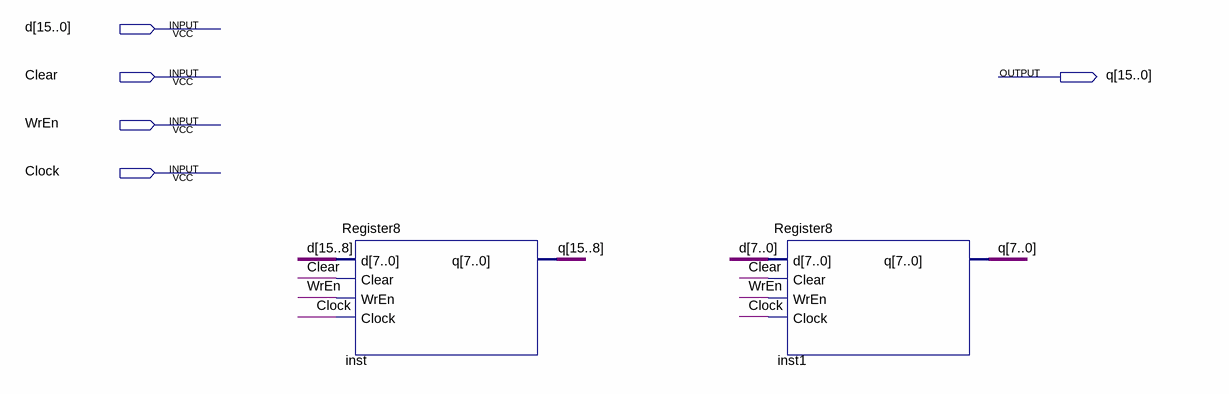
[diagram p0: schematic sheet]
// Quartus schematic Register16.bdf as structural Verilog: 2 symbols, 5 pins
module Register16 (
  input  [15:0] d,
  input  Clear,
  input  WrEn,
  input  Clock,
  output [15:0] q
);

  Register8 inst (.d(d[15:8]), .Clear(Clear), .WrEn(WrEn), .Clock(Clock), .q(q[15:8]));
  Register8 inst1 (.d(d[7:0]), .Clear(Clear), .WrEn(WrEn), .Clock(Clock), .q(q[7:0]));
endmodule
